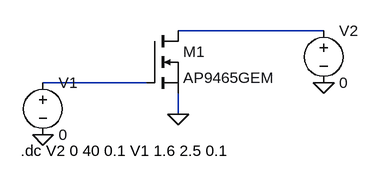
[diagram p0: schematic Выходная.asc]
Выходная.asc, the LTspice schematic file:
Version 4
SHEET 1 880 680
WIRE 352 144 128 144
WIRE 80 224 -80 224
WIRE 128 272 128 240
FLAG -80 304 0
FLAG 128 272 0
FLAG 352 224 0
SYMBOL nmos 80 144 R0
SYMATTR InstName M1
SYMATTR Value AP9465GEM
SYMBOL voltage -80 208 R0
SYMATTR InstName V1
SYMATTR Value 0
SYMBOL voltage 352 128 R0
SYMATTR InstName V2
SYMATTR Value 0
TEXT -114 328 Left 2 !.dc V2 0 40 0.1 V1 1.6 2.5 0.1

The netlist it stands for:
* Выходная.asc
M1 N001 N002 0 0 AP9465GEM
V1 N002 0 0
V2 N001 0 0
.model NMOS NMOS
.model PMOS PMOS
.lib standard.mos
.dc V2 0 40 0.1 V1 1.6 2.5 0.1
.backanno
.end